# Altium schematic sheet Adapter.SchDoc
size A4; Organization: HOME; Address1: L3, 12a Rodborough Rd; Address2: Frenchs Forest; Address3: NSW; Address4: Australia 2086; PageSetup: Record=PageOptions|CenterHorizontal=True|CenterVertical=True|PrintScale=0.49|XCorrection=1.00|YCorrection=1.00|PrintKind=0|BorderSize=5000000|LeftOffset=0|BottomOffset=0|Orientation=2|PaperLength=1000|PaperWidth=1000|Scale=100|PaperSource=7|PrintQuality=-3|MediaType=1|DitherType=10|PrintScaleMode=1|PaperKind=A4|PaperIndex=9
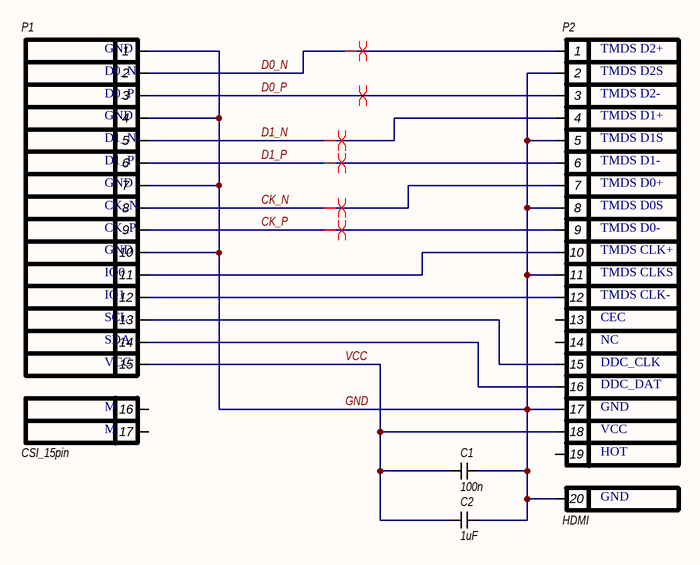
[diagram p0: Adapter.SchDoc]

## Parts
C1  100n  [CAP_0603]
C2  1uF  [CAP_0603]
P1  CSI_15pin  [FDC CSI 15pin]
P2  HDMI  [HDMI TYPE A]

## Nets
CK_N: P1.8 P2.7
CK_P: P1.9 P2.9
D0_N: P1.2 P2.1
D0_P: P1.3 P2.3
D1_N: P1.5 P2.4
D1_P: P1.6 P2.6
GND: C1.2 C2.2 P1.1 P1.4 P1.7 P1.10 P2.2 P2.5 P2.8 P2.11 P2.17 P2.20
VCC: C1.1 C2.1 P1.15 P2.18
NetP1_11: P1.11 P2.10
NetP1_12: P1.12 P2.12
NetP1_13: P1.13 P2.15
NetP1_14: P1.14 P2.16

Not connected (* = marked no-connect by the designer): P1 16 17; P2 13 14 19

## Layout directives
differential pair: CK_N, CK_P, D0_N, D0_P, D1_N, D1_P

## Notes on the sheet
- Title
- Size:
- Date:
- File:
- A2
- Number:
- Time:
- Revision:
- Sheet
- of

## Library data of the parts
C1 C2 = Capacitor
  C1: Value: 100n
  C2: Value: 1uF
P1 = Port 17: P1: GND; P2: D0_N; P3: D0_P; P5: D1_N; P6: D1_P; P8: CK_N; P9: CK_P; P11: IO0; P12: IO1; P13: SCL; P14: SDA; P15: VCC; P16: M; P4: GND; P7: GND; P10: GND; P17: M
P2 = Port 20: pin to pad: 20>S1; P1: TMDS D2+; P2: TMDS D2S; P3: TMDS D2-; P4: TMDS D1+; P5: TMDS D1S; P6: TMDS D1-; P7: TMDS D0+; P8: TMDS D0S; P9: TMDS D0-; P10: TMDS CLK+; P11: TMDS CLKS; P12: TMDS CLK-; P13: CEC; P14: NC; P15: DDC_CLK; P16: DDC_DAT; P17: GND; P18: VCC; P19: HOT; P20: GND